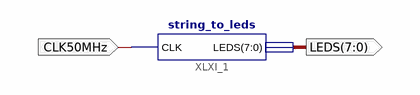
[diagram p0: schematic sheet 1]
// Xilinx ISE schematic string_to_led_schema.sch (spartan3e) as structural Verilog: 1 symbols, 2 ports
module string_to_led_schema (
  input  CLK50MHz,
  output [7:0] LEDS
);

  string_to_leds XLXI_1 (.CLK(CLK50MHz), .LEDS(LEDS));
endmodule
